# Altium schematic sheet MC33797.SchDoc: Top Sheet
size A4; Project: World Domination Satellite
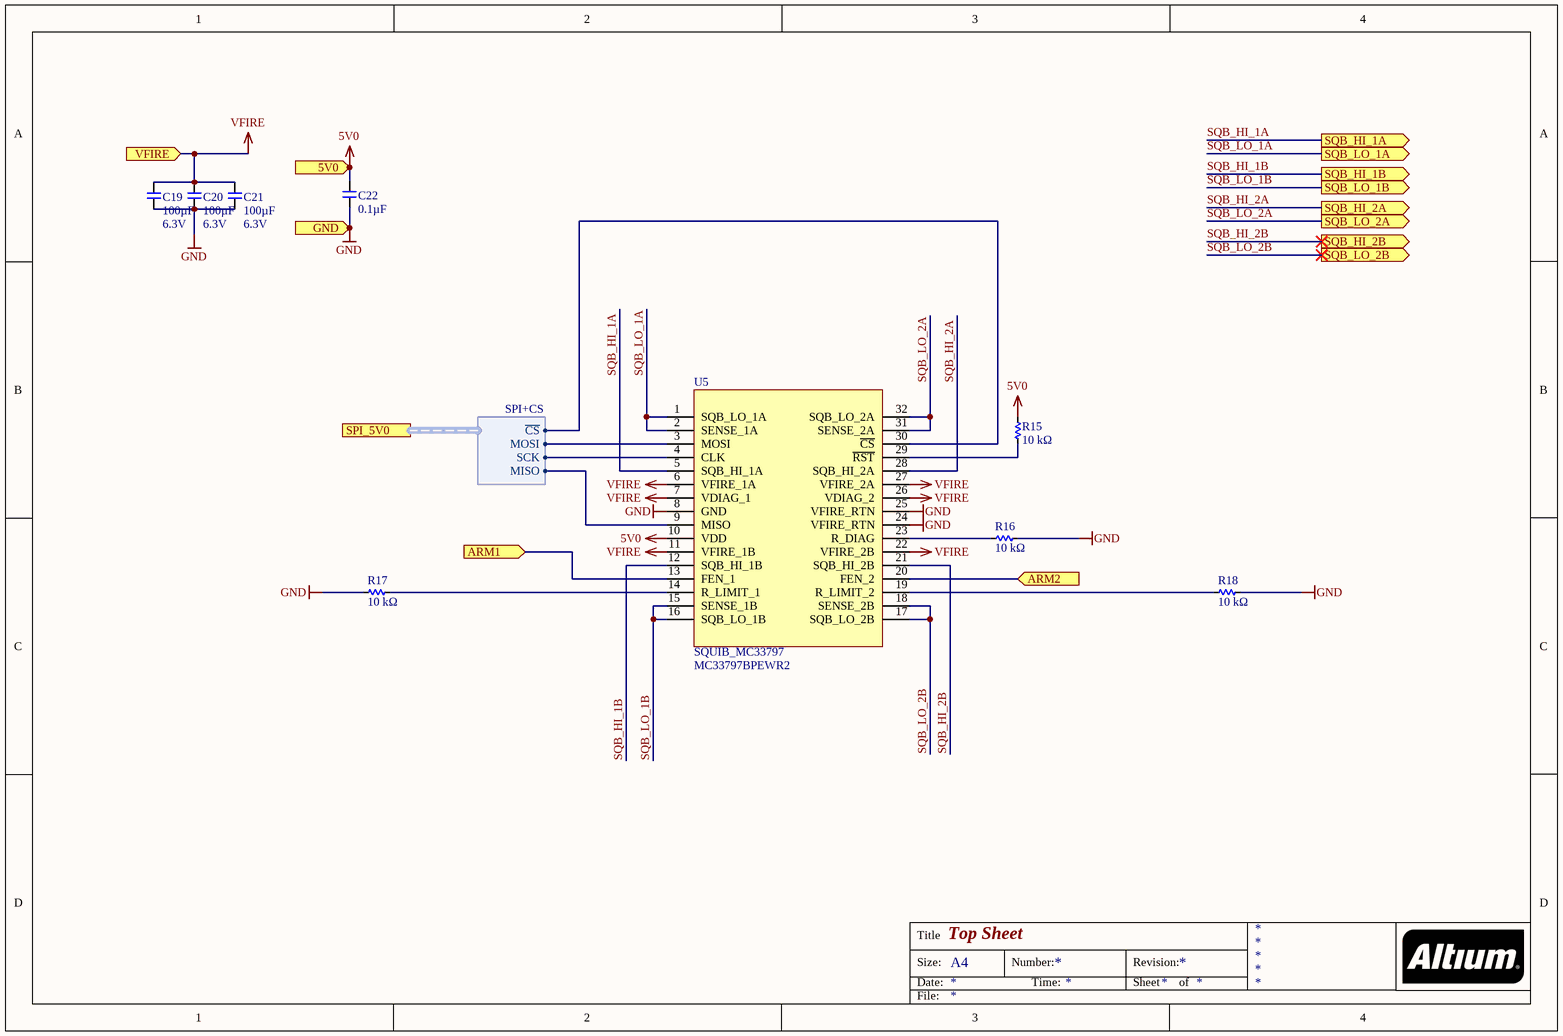
[diagram p0: MC33797.SchDoc]

## Parts
C19  Capacitance: 100µF  Voltage - Rated: 6.3V  [C1206]  (hidden comment: CAP_100UF_1206_SMD)
C20  Capacitance: 100µF  Voltage - Rated: 6.3V  [C1206]  (hidden comment: CAP_100UF_1206_SMD)
C21  Capacitance: 100µF  Voltage - Rated: 6.3V  [C1206]  (hidden comment: CAP_100UF_1206_SMD)
C22  Capacitance (shorthand): 0.1µF  [C0603]  (hidden comment: __template_cap)
R15  Resistance: 10 kΩ  [R0603]  (hidden comment: __template_resistor)
R16  Resistance: 10 kΩ  [R0603]  (hidden comment: __template_resistor)
R17  Resistance: 10 kΩ  [R0603]  (hidden comment: __template_resistor)
R18  Resistance: 10 kΩ  [R0603]  (hidden comment: __template_resistor)
U5  SQUIB_MC33797  Manufacturer Part Number: MC33797BPEWR2  [SOT1762-1]

## Ports
5V0 (in), ARM1 (in), ARM2 (in), GND (in), SPI_5V0 (harness SPI+CS), SQB_HI_1A (out), SQB_HI_1B (out), SQB_HI_2A (out), SQB_HI_2B (out), SQB_LO_1A (out), SQB_LO_1B (out), SQB_LO_2A (out), SQB_LO_2B (out), VFIRE (in)

## Harnesses
SPI+CS: ~{CS}, SCK, MOSI, MISO

## Nets
5V0: C22.1 R15.2 U5.10(VDD) ; port 5V0
GND: C19.2 C20.2 C21.2 C22.2 R16.2 R17.1 R18.2 U5.8(GND) U5.24(VFIRE_RTN) U5.25(VFIRE_RTN) ; port GND
VFIRE: C19.1 C20.1 C21.1 U5.6(VFIRE_1A) U5.7(VDIAG_1) U5.11(VFIRE_1B) U5.22(VFIRE_2B) U5.26(VDIAG_2) U5.27(VFIRE_2A) ; port VFIRE
ARM1: U5.13(FEN_1) ; port ARM1
ARM2: U5.20(FEN_2) ; port ARM2
SQB_HI_1A: U5.5(SQB_HI_1A) ; port SQB_HI_1A
SQB_HI_1B: U5.12(SQB_HI_1B) ; port SQB_HI_1B
SQB_HI_2A: U5.28(SQB_HI_2A) ; port SQB_HI_2A
SQB_HI_2B: U5.21(SQB_HI_2B) ; port SQB_HI_2B
SQB_LO_1A: U5.1(SQB_LO_1A) U5.2(SENSE_1A) ; port SQB_LO_1A
SQB_LO_1B: U5.15(SENSE_1B) U5.16(SQB_LO_1B) ; port SQB_LO_1B
SQB_LO_2A: U5.31(SENSE_2A) U5.32(SQB_LO_2A) ; port SQB_LO_2A
SQB_LO_2B: U5.17(SQB_LO_2B) U5.18(SENSE_2B) ; port SQB_LO_2B
NetR15_1: R15.1 U5.29(~{RST})
NetR16_1: R16.1 U5.23(R_DIAG)
NetR17_2: R17.2 U5.14(R_LIMIT_1)
NetR18_1: R18.1 U5.19(R_LIMIT_2)
NetU5_3: U5.3(MOSI) ; port SPI_5V0.MOSI
NetU5_4: U5.4(CLK) ; port SPI_5V0.SCK
NetU5_9: U5.9(MISO) ; port SPI_5V0.MISO
NetU5_30: U5.30(~{CS}) ; port SPI_5V0.~{CS}

## Notes on the sheet
- Title
- Size:
- Date:
- A4
- Number:
- Time:
- Revision:
- Sheet
- of
- File:

## Library data of the parts
C19-C21 = CAP_100UF_1206_SMD: 100UF SMD CAP CERAMIC; Manufacturer: Murata Electronics North America; Manufacturer Part Number: GRM31CD80J107ME39L; Tolerance: ±20%; Temperature Coefficient: X6T; RoHS: RoHS Compliant; Category: Capacitors; Packaging: Cut Tape (CT); Part Status: Active; Operating Temperature: -55°C ~ 105°C; Features: Derating Recommended; Ratings: -; Applications: General Purpose; Mounting Type: Surface Mount, MLCC; Package / Case: 1206 (3216 Metric); Size / Dimension: 0.126" L x 0.063" W (3.20mm x 1.60mm); Height - Seated (Max): -; Thickness (Max): 0.071" (1.80mm); Lead Spacing: -; Lead Style: -; Supplier 1: Digi-Key; Supplier Part Number 1: 490-10525-1-ND; Stock 1: 406964; Pricing 1: 1=0.55, 10=0.388, 25=0.3308, 50=0.2932, 100=0.2553, 250=0.21748, 500=0.1891, 1000=0.16074 (USD); ComponentLink1URL: http://www.murata.com/~/media/webrenewal/support/library/catalog/products/capacitor/mlcc/c02e.ashx; ComponentLink1Description: http://www.murata.com/~/media/webrenewal/support/library/catalog/products/capacitor/mlcc/c02e.ashx
C22 = 490-1519-1-ND: CAP CER 0603 0.1µF X7R 50V 10%; Manufacturer: Murata Electronics North America; Capacitance - pF (Machine readable): #NAME?; type: capacitor; Rated Voltage: 50V; Dielectric: X7R; Supplier Part Number 1: 490-1519-1-ND; Supplier 1: Digikey
R15-R18 = 311-10.0KHRCT-ND: RES SMD 10K OHM 1% 1/10W 0603; Manufacturer Part Number: RC0603FR-0710KL; Manufacturer: Yageo; Resistance (Sortable): 10000; Power (Watts): 0.1W, 1/10W; Temperature Coefficient: ±100ppm/°C; Supplier 1: Digikey; Datasheets: http://www.yageo.com/documents/recent/PYu-RC_Group_51_RoHS_L_9.pdf; Image: //media.digikey.com/Renders/Yageo%20Renders/0603-(1608-Metric).jpg; Supplier Part Number 1: 311-10.0KHRCT-ND; Tolerance: ±1%; Operating Temperature: -55°C ~ 155°C
U5 = SQUIB_MC33797: Manufacturer: NXP USA Inc.; Interface: SPI; Voltage - Supply: 4.75 V ~ 5.25 V; Supplier 1: Digi-Key; RoHS: RoHS Compliant; Category: Integrated Circuits (ICs); Stock 1: 657; Pricing 1: 1=4.94, 10=4.437, 100=3.6354, 500=3.2136 (USD); Packaging: Cut Tape (CT); Part Status: Active; Applications: -; Package / Case: 32-SOIC (0.295", 7.50mm Width); Supplier Device Package: 32-SOIC; Mounting Type: Surface Mount; ComponentLink1URL: http://cache.freescale.com/files/analog/doc/data_sheet/MC33797.pdf; ComponentLink1Description: http://cache.freescale.com/files/analog/doc/data_sheet/MC33797.pdf; Supplier Part Number 1: MC33797BPEWR2CT-ND